# Altium schematic sheet GIC_G1.SchDoc
size A4
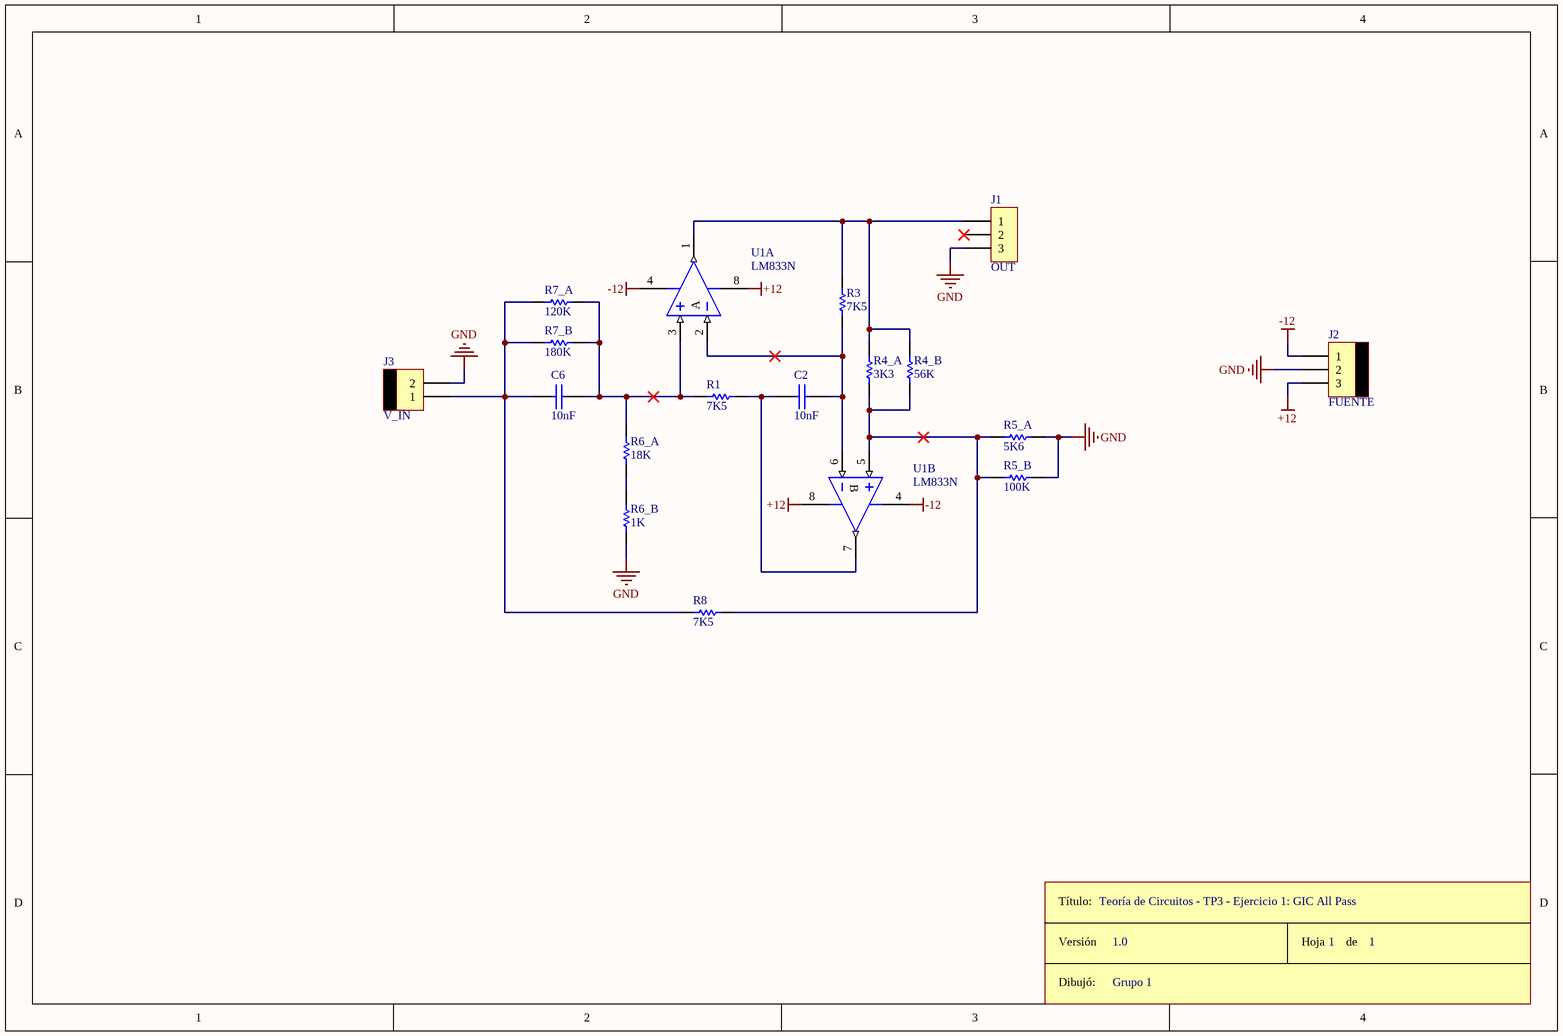
[diagram p0: GIC_G1.SchDoc]

## Parts
*  Rótulo  (value not drawn)
C2  10nF  [CAP100]
C6  10nF  [CAP100]
J1  OUT  [SIP3]
J2  FUENTE  [MOLEX3]
J3  V_IN  [MOLEX2]
R1  7K5  [RES400]
R3  7K5  [RES400]
R4_A  3K3  [RES400]
R4_B  56K  [RES400]
R5_A  5K6  [RES400]
R5_B  100K  [RES400]
R6_A  18K  [RES400]
R6_B  1K  [RES400]
R7_A  120K  [RES400]
R7_B  180K  [RES400]
R8  7K5  [RES400]
U1  LM833N  [DIP8]  (parts A,B of 2)

## Nets
+12: J2.3 U1.8(V+)
-12: J2.1 U1.4(V-)
GND: J1.3 J2.2 J3.2 R5_A.2 R5_B.2 R6_B.1
NetC2_1: C2.1 R1.2 U1.7(OUT)
NetC2_2: C2.2 R3.1 U1.2(IN-) U1.6(IN-)
NetC6_1: C6.1 J3.1 R7_A.2 R7_B.1 R8.1
NetC6_2: C6.2 R1.1 R6_A.2 R7_A.1 R7_B.2 U1.3(IN+)
NetJ1_1: J1.1 R3.2 R4_A.2 R4_B.1 U1.1(OUT)
NetR4_A_1: R4_A.1 R4_B.2 R5_A.1 R5_B.1 R8.2 U1.5(IN+)
NetR6_A_1: R6_A.1 R6_B.2

Not connected (* = marked no-connect by the designer): J1 2*

## Notes on the sheet
- Teoría de Circuitos - TP3 - Ejercicio 1: GIC All Pass
- 1.0
- Grupo 1
- 1
- (in symbol LM833N, part A) A
- (in symbol LM833N, part B) B
- (in symbol Rótulo) Título:; Versión; Hoja       de; Dibujó:

## Library data of the parts
C2 C6 = CAP
J1 = CON3
J2 = MOLEX3
J3 = MOLEX2
R1 R3 R4_A R4_B R5_A R5_B R6_A R6_B R7_A R7_B R8 = RES
U1 = LM833N: Low-Noise Dual Operational Amplifier; Published: 24-Aug-2001; LatestRevisionDate: 06-Jun-2005; LatestRevisionNote: Stylized 3D Model Added.; DatasheetVersion: Dec-1997; PackageReference: DIP8; Publisher: Altium Limited; PackageDescription: DIP; 8 Leads; Row Spacing 7.62 mm; Pitch 2.54 mm; Code_JEDEC: MO-001-AN; ComponentLink1Description: Manufacturer Link; ComponentLink1URL: http://www.st.com/; ComponentLink2Description: Datasheet; ComponentLink2URL: http://www.st.com/stonline/products/literature/ds/2169/lm833.pdf